# Altium schematic sheet p02_power.SchDoc
size A
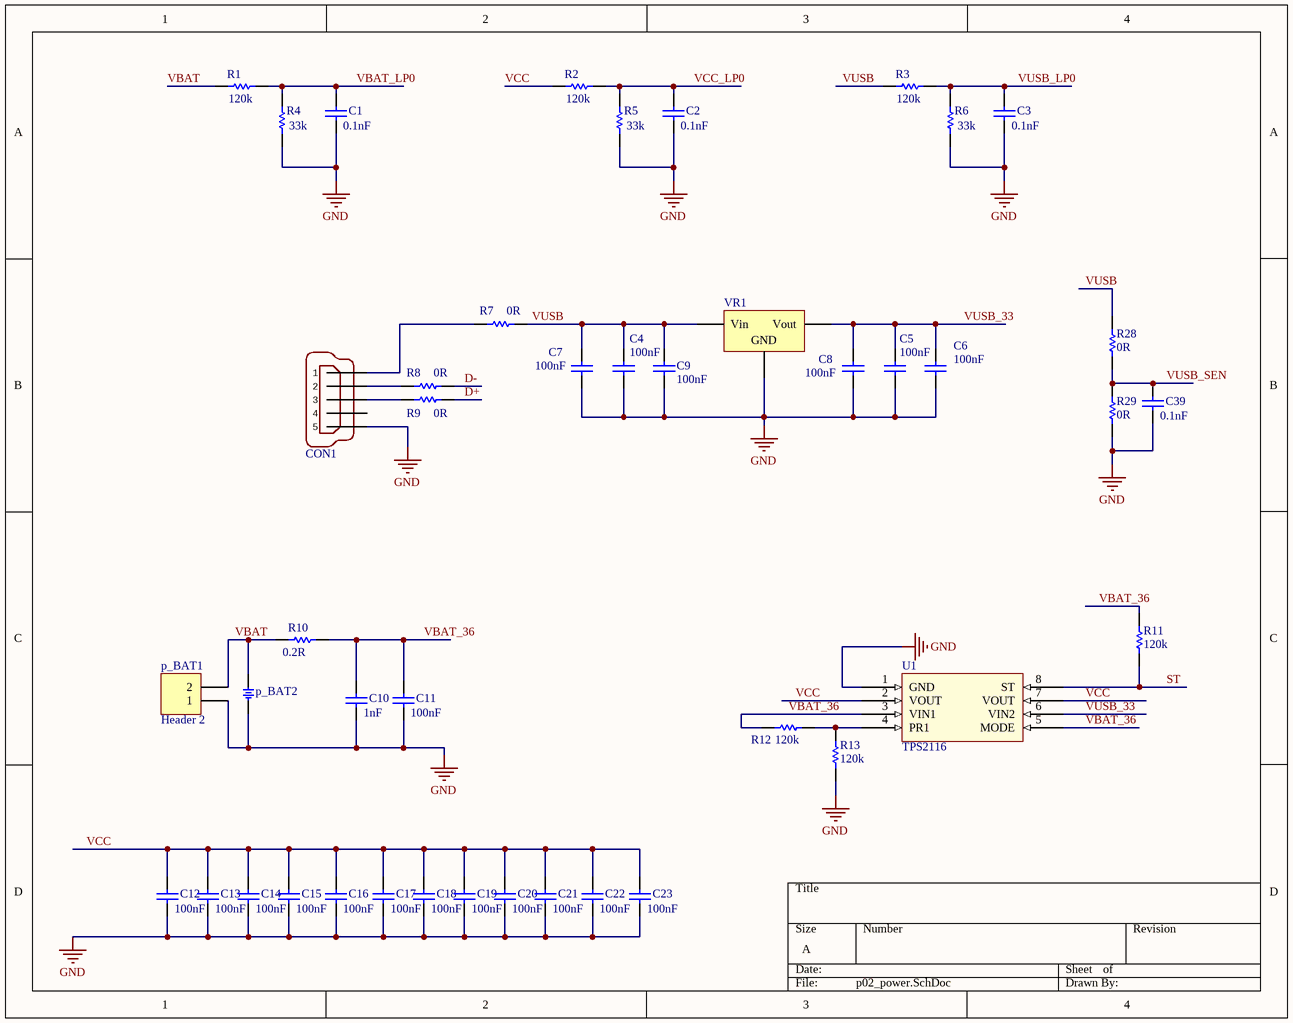
[diagram p0: p02_power.SchDoc]

## Parts
C1  value 0.1nF  [C0805]  (hidden comment: Cap)
C2  value 0.1nF  [C0805]  (hidden comment: Cap)
C3  value 0.1nF  [C0805]  (hidden comment: Cap)
C4  value 100nF  [C0805]  (hidden comment: Cap)
C5  value 100nF  [C0805]  (hidden comment: Cap)
C6  value 100nF  [C0805]  (hidden comment: Cap)
C7  value 100nF  [C0805]  (hidden comment: Cap)
C8  value 100nF  [C0805]  (hidden comment: Cap)
C9  value 100nF  [C0805]  (hidden comment: Cap)
C10  value 1nF  [C0805]  (hidden comment: Cap)
C11  value 100nF  [C0805]  (hidden comment: Cap)
C12  value 100nF  [C0805]  (hidden comment: Cap)
C13  value 100nF  [C0805]  (hidden comment: Cap)
C14  value 100nF  [C0805]  (hidden comment: Cap)
C15  value 100nF  [C0805]  (hidden comment: Cap)
C16  value 100nF  [C0805]  (hidden comment: Cap)
C17  value 100nF  [C0805]  (hidden comment: Cap)
C18  value 100nF  [C0805]  (hidden comment: Cap)
C19  value 100nF  [C0805]  (hidden comment: Cap)
C20  value 100nF  [C0805]  (hidden comment: Cap)
C21  value 100nF  [C0805]  (hidden comment: Cap)
C22  value 100nF  [C0805]  (hidden comment: Cap)
C23  value 100nF  [C0805]  (hidden comment: Cap)
C39  value 0.1nF  [C0805]  (hidden comment: Cap)
CON1  897-43-005-00-100001  [USB-MINI-B-5P-SMD]  (value not drawn)
p_BAT1  Header 2  [HDR1X2]
p_BAT2  (no value)  [BTH2032]
R1  value 120k  [6-0805_M]  (hidden comment: Res1)
R2  value 120k  [6-0805_M]  (hidden comment: Res1)
R3  value 120k  [6-0805_M]  (hidden comment: Res1)
R4  value 33k  [6-0805_M]  (hidden comment: Res1)
R5  value 33k  [6-0805_M]  (hidden comment: Res1)
R6  value 33k  [6-0805_M]  (hidden comment: Res1)
R7  0R  [6-0805_M]
R8  0R  [6-0805_M]
R9  0R  [6-0805_M]
R10  value 0.2R  [6-0805_M]  (hidden comment: Res1)
R11  value 120k  [6-0805_M]  (hidden comment: Res1)
R12  value 120k  [6-0805_M]  (hidden comment: Res1)
R13  value 120k  [6-0805_M]  (hidden comment: Res1)
R28  0R  [6-0805_M]
R29  0R  [6-0805_M]
U1  TPS2116  [SOIC127P600X175-8N]
VR1  Volt Reg  [D2PAK_N]  (value not drawn)

## Nets
GND: C1.2 C2.2 C3.2 C4.1 C5.1 C6.1 C7.1 C8.1 C9.1 C10.1 C11.1 C12.1 C13.1 C14.1 C15.1 C16.1 C17.1 C18.1 C19.1 C20.1 C21.1 C22.1 C23.1 C39.2 CON1.5 p_BAT1.1 p_BAT2.2 R4.2 R5.2 R6.2 R13.2 R29.2 U1.1(GND) VR1.2(GND)
D+: R9.1
D-: R8.1
ST: R11.2 U1.8(ST)
VBAT: p_BAT1.2 p_BAT2.1 R1.2 R10.2
VBAT_36: C10.2 C11.2 R10.1 R11.1 R12.1 U1.3(VIN1) U1.5(MODE)
VBAT_LP0: C1.1 R1.1 R4.1
VCC: C12.2 C13.2 C14.2 C15.2 C16.2 C17.2 C18.2 C19.2 C20.2 C21.2 C22.2 C23.2 R2.2 U1.2(VOUT) U1.7(VOUT)
VCC_LP0: C2.1 R2.1 R5.1
VUSB: C4.2 C7.2 C9.2 R3.2 R7.1 R28.1 VR1.1(Vin)
VUSB_33: C5.2 C6.2 C8.2 U1.6(VIN2) VR1.3(Vout)
VUSB_LP0: C3.1 R3.1 R6.1
VUSB_SEN: C39.1 R28.2 R29.1
NetCON1_1: CON1.1 R7.2
NetCON1_2: CON1.2 R8.2
NetCON1_3: CON1.3 R9.2
NetR12_2: R12.2 R13.1 U1.4(PR1)

Not connected (* = marked no-connect by the designer): CON1 4

## Library data of the parts
C1-C23 C39 = Cap: Capacitor; Published: 8-Jun-2000; LatestRevisionDate: 17-Jul-2002; LatestRevisionNote: Re-released for DXP Platform.; PackageReference: RAD-0.3; Publisher: Altium Limited; PackageDescription: Radial Cap, Thru-Hole; 2 Leads; 0.3 in Pin Spacing
CON1 = MINI-USB-32005-201: Connector,MiniUSB B port,5 position,Right Angle,Gold flash 30u,black,SMD; Manufacturer: MILL-MAX; Embest PN: 1009007100067; Value: 897-43-005-00-100001; Part Type: USB Connector; Manufacturer Part Number: 897-43-005-00-100001
p_BAT1 = Header 2: Header, 2-Pin; LatestRevisionDate: 17-Jul-2002; LatestRevisionNote: Re-released for DXP Platform.; Publisher: Altium Limited
p_BAT2 = BATH_CR2032: BATTERY HOLDER, CR2032; MANF_P#: -; .: http://www.chila.ir
R1-R6 R10-R13 = Res1: Resistor; Published: 8-Jun-2000; LatestRevisionDate: 17-Jul-2002; LatestRevisionNote: Re-released for DXP Platform.; PackageReference: AXIAL-0.3; Publisher: Altium Limited; PackageDescription: Axial Device, Thru-Hole; 2 Leads; 0.3 in Pin Spacing
R7-R9 R28 R29 = Res1: Resistor; Value: 0.2R; Published: 8-Jun-2000; LatestRevisionDate: 17-Jul-2002; LatestRevisionNote: Re-released for DXP Platform.; PackageReference: AXIAL-0.3; Publisher: Altium Limited; PackageDescription: Axial Device, Thru-Hole; 2 Leads; 0.3 in Pin Spacing
U1 = TPS2116: TPS2116 1.6 V to 5.5 V, 2.5-A Low IQ Power Mux with Manual and Priority Switchover
VR1 = Volt Reg: Voltage Regulator; Published: 24-Mar-1999; LatestRevisionDate: 29-May-2009; LatestRevisionNote: IPC-7351 Footprint Added.; PackageReference: D2PAK; Publisher: Altium Limited; PackageDescription: 3-Pin Transistor Outline Package 2.54 mm Pitch, 15.1 mm Lead Span